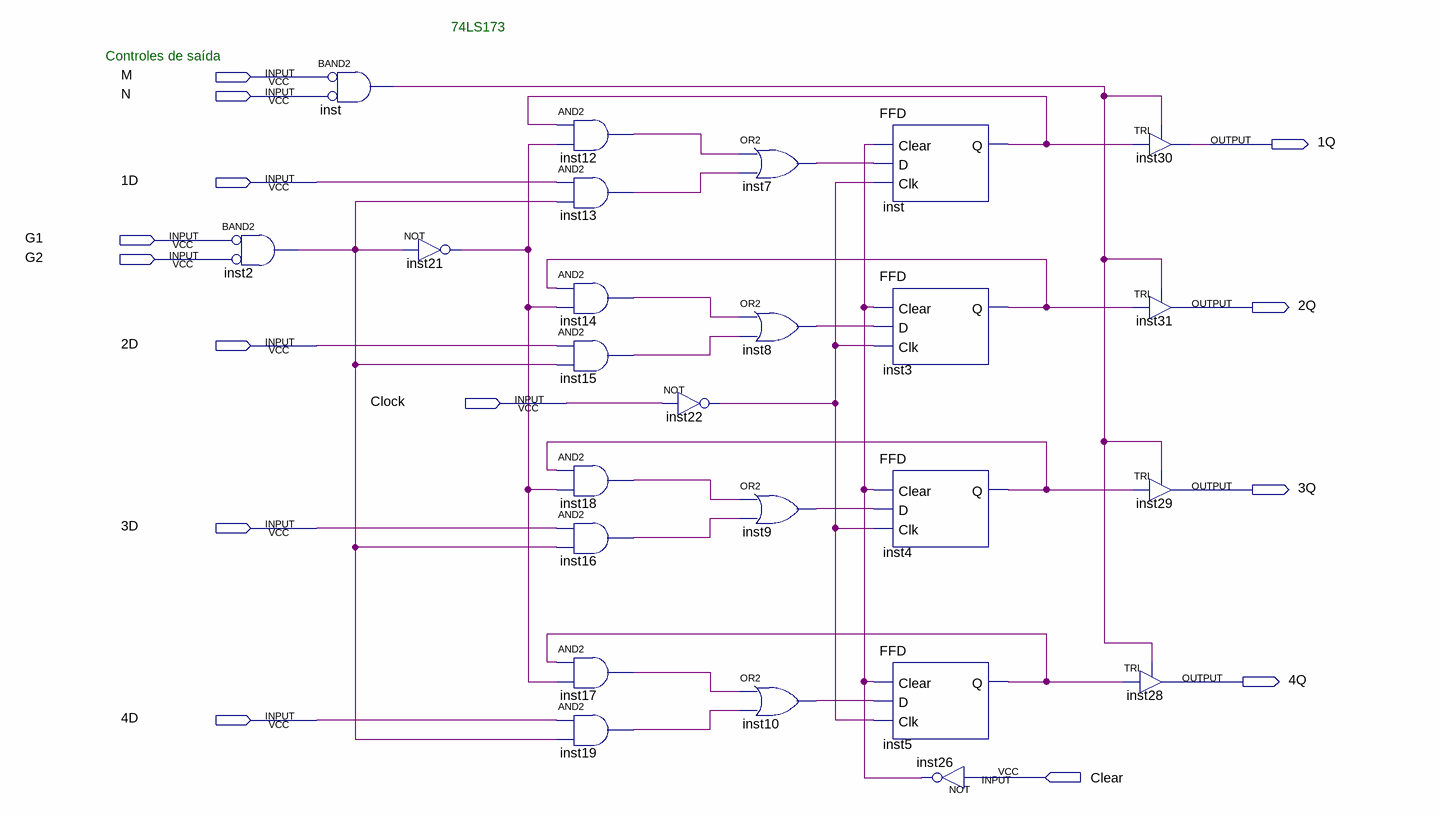
[diagram p0: schematic sheet]
// Quartus schematic 74LS183 - Registrador.bdf as structural Verilog: 25 symbols, 14 pins
module \74LS183_-_Registrador  (
  input  M,
  input  N,
  input  \1D ,
  input  G1,
  input  G2,
  input  \2D ,
  input  Clock,
  input  \3D ,
  input  \4D ,
  input  Clear,
  output \1Q ,
  output \2Q ,
  output \3Q ,
  output \4Q 
);

  wire inst2_out, inst3_q, inst4_q, inst5_q, inst7_out, inst8_out, inst9_out, inst10_out, inst12_out,
       inst13_out, inst14_out, inst15_out, inst16_out, inst17_out, inst18_out, inst19_out, inst21_out,
       inst22_out, inst26_out, inst_out, inst_q;

  and inst2 (inst2_out, ~G1, ~G2);  // BAND2
  and inst (inst_out, ~M, ~N);  // BAND2
  not inst21 (inst21_out, inst2_out);
  and inst12 (inst12_out, inst_q, inst21_out);
  and inst13 (inst13_out, \1D , inst2_out);
  and inst14 (inst14_out, inst3_q, inst21_out);
  and inst15 (inst15_out, \2D , inst2_out);
  and inst18 (inst18_out, inst4_q, inst21_out);
  and inst16 (inst16_out, \3D , inst2_out);
  and inst17 (inst17_out, inst5_q, inst21_out);
  and inst19 (inst19_out, \4D , inst2_out);
  not inst22 (inst22_out, Clock);
  or inst7 (inst7_out, inst12_out, inst13_out);
  or inst8 (inst8_out, inst14_out, inst15_out);
  or inst9 (inst9_out, inst18_out, inst16_out);
  or inst10 (inst10_out, inst17_out, inst19_out);
  FFD inst_dup2 (.Clear(inst26_out), .D(inst7_out), .Clk(inst22_out), .Q(inst_q));
  FFD inst3 (.Clear(inst26_out), .D(inst8_out), .Clk(inst22_out), .Q(inst3_q));
  FFD inst4 (.Clear(inst26_out), .D(inst9_out), .Clk(inst22_out), .Q(inst4_q));
  FFD inst5 (.Clear(inst26_out), .D(inst10_out), .Clk(inst22_out), .Q(inst5_q));
  not inst26 (inst26_out, Clear);
  TRI inst30 (.IN(inst_q), .OE(inst_out), .OUT(\1Q ));
  TRI inst31 (.IN(inst3_q), .OE(inst_out), .OUT(\2Q ));
  TRI inst29 (.IN(inst4_q), .OE(inst_out), .OUT(\3Q ));
  TRI inst28 (.IN(inst5_q), .OE(inst_out), .OUT(\4Q ));

  // Notes on the sheet:
  //   74LS173
  //   Controles de saída
endmodule
